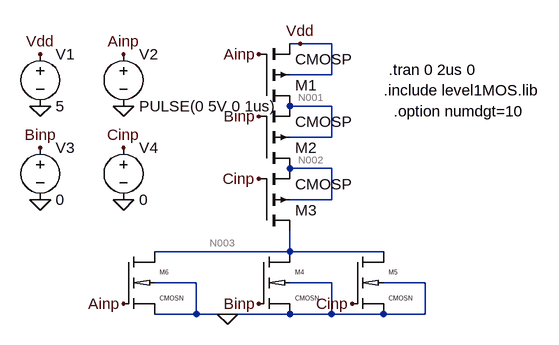
[diagram p0: schematic NOR.asc]
NOR.asc, the LTspice schematic file:
Version 4
SHEET 1 880 680
WIRE 224 16 208 16
WIRE 272 16 224 16
WIRE 272 64 272 16
WIRE 272 64 208 64
WIRE 272 112 208 112
WIRE 272 160 272 112
WIRE 272 160 208 160
WIRE 272 208 208 208
WIRE 272 256 272 208
WIRE 272 256 208 256
WIRE 208 336 208 304
WIRE 208 336 0 336
WIRE 352 336 208 336
WIRE 64 384 0 384
WIRE 272 384 208 384
WIRE 416 384 352 384
WIRE 64 432 64 384
WIRE 64 432 0 432
WIRE 112 432 64 432
WIRE 208 432 112 432
WIRE 272 432 272 384
WIRE 272 432 208 432
WIRE 352 432 272 432
WIRE 416 432 416 384
WIRE 416 432 352 432
FLAG 112 432 0
FLAG -176 32 Vdd
FLAG 224 16 Vdd
FLAG -48 32 Ainp
FLAG 160 32 Ainp
FLAG -48 416 Ainp
FLAG -176 176 Binp
FLAG 160 128 Binp
FLAG 160 416 Binp
FLAG -48 176 Cinp
FLAG 304 416 Cinp
FLAG -48 256 0
FLAG -48 112 0
FLAG -176 112 0
FLAG -176 256 0
FLAG 160 224 Cinp
SYMBOL cmosp 160 112 M180
SYMATTR InstName M1
SYMATTR Value2 l=0.36u w=2.16u
SYMBOL cmosp 160 208 M180
SYMATTR InstName M2
SYMATTR Value2 l=0.36u w=2.16u
SYMBOL cmosp 160 304 M180
SYMATTR InstName M3
SYMATTR Value2 l=0.36u w=2.16u
SYMBOL cmosn 160 336 R0
SYMATTR InstName M4
SYMATTR Value2 l=1.08u w=0.36u
SYMBOL cmosn 304 336 R0
SYMATTR InstName M5
SYMATTR Value2 l=1.08u w=0.36u
SYMBOL cmosn -48 336 R0
SYMATTR InstName M6
SYMATTR Value2 l=1.08u w=0.36u
SYMBOL voltage -176 16 R0
WINDOW 123 0 0 Left 2
WINDOW 39 0 0 Left 2
SYMATTR InstName V1
SYMATTR Value 5
SYMBOL voltage -48 16 R0
WINDOW 123 0 0 Left 2
WINDOW 39 0 0 Left 2
SYMATTR InstName V2
SYMATTR Value PULSE(0 5V 0 1us)
SYMBOL voltage -176 160 R0
WINDOW 123 0 0 Left 2
WINDOW 39 0 0 Left 2
SYMATTR InstName V3
SYMATTR Value 0
SYMBOL voltage -48 160 R0
WINDOW 123 0 0 Left 2
WINDOW 39 0 0 Left 2
SYMATTR InstName V4
SYMATTR Value 0
TEXT 360 56 Left 2 !.tran 0 2us 0
TEXT 352 88 Left 2 !.include level1MOS.lib
TEXT 368 120 Left 2 !.option numdgt=10

The netlist it stands for:
* NOR.asc
M1 N001 Ainp Vdd Vdd CMOSP l=0.36u w=2.16u
M2 N002 Binp N001 N001 CMOSP l=0.36u w=2.16u
M3 N003 Cinp N002 N002 CMOSP l=0.36u w=2.16u
M4 N003 Binp 0 0 CMOSN l=1.08u w=0.36u
M5 N003 Cinp 0 0 CMOSN l=1.08u w=0.36u
M6 N003 Ainp 0 0 CMOSN l=1.08u w=0.36u
V1 Vdd 0 5
V2 Ainp 0 PULSE(0 5V 0 1us)
V3 Binp 0 0
V4 Cinp 0 0
.model NMOS NMOS
.model PMOS PMOS
.lib standard.mos
.tran 0 2us 0
.include level1MOS.lib
.option numdgt=10
.lib tsmc018.lib
.backanno
.end

* Results of the author's LTspice run, read from the files saved beside the schematic
* Operating Point, zero values left out:
*   V(n001) = 5 V
*   V(vdd) = 5 V
*   V(n002) = 5 V
*   V(n003) = 5 V
*   Id(M6) = 10.01 pA
*   Ib(M6) = -5.01 pA
*   Is(M6) = -5 pA
*   Id(M5) = 10.01 pA
*   Ib(M5) = -5.01 pA
*   Is(M5) = -5 pA
*   Id(M4) = 10.01 pA
*   Ib(M4) = -5.01 pA
*   Is(M4) = -5 pA
*   Id(M3) = 148.5 pA
*   Is(M3) = -148.5 pA
*   Id(M2) = 1.095 nA
*   Is(M2) = -1.095 nA
*   Id(M1) = -30.03 pA
*   Is(M1) = 30.03 pA
*   I(V1) = -30.03 pA
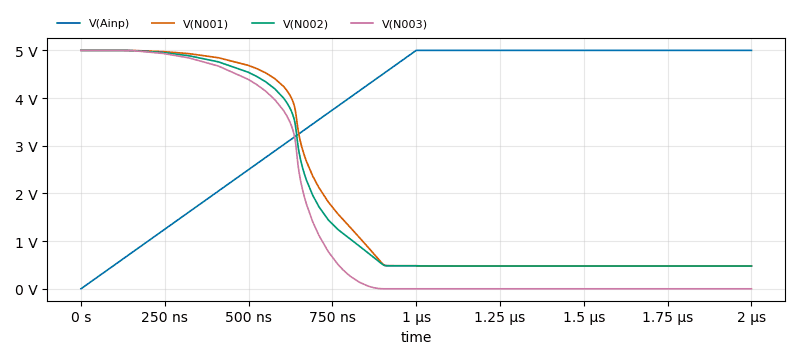
[diagram p1: Transient Analysis of NOR.asc, plotted from the saved traces]
* Transient Analysis, 1 run:
*   V(Ainp): min 0 V, max 5 V, average 3.75 V, rms 4.083 V, last 5 V
*   V(N001): min 477.3 mV, max 5 V, average 2.019 V, rms 2.826 V, last 477.3 mV
*   V(N002): min 477.2 mV, max 5 V, average 1.959 V, rms 2.765 V, last 477.2 mV
*   V(N003): min 0 V, max 5 V, average 1.586 V, rms 2.671 V, last 0 V